# EAGLE design seven_seg_thermocouple_one (EAGLE 6.1)
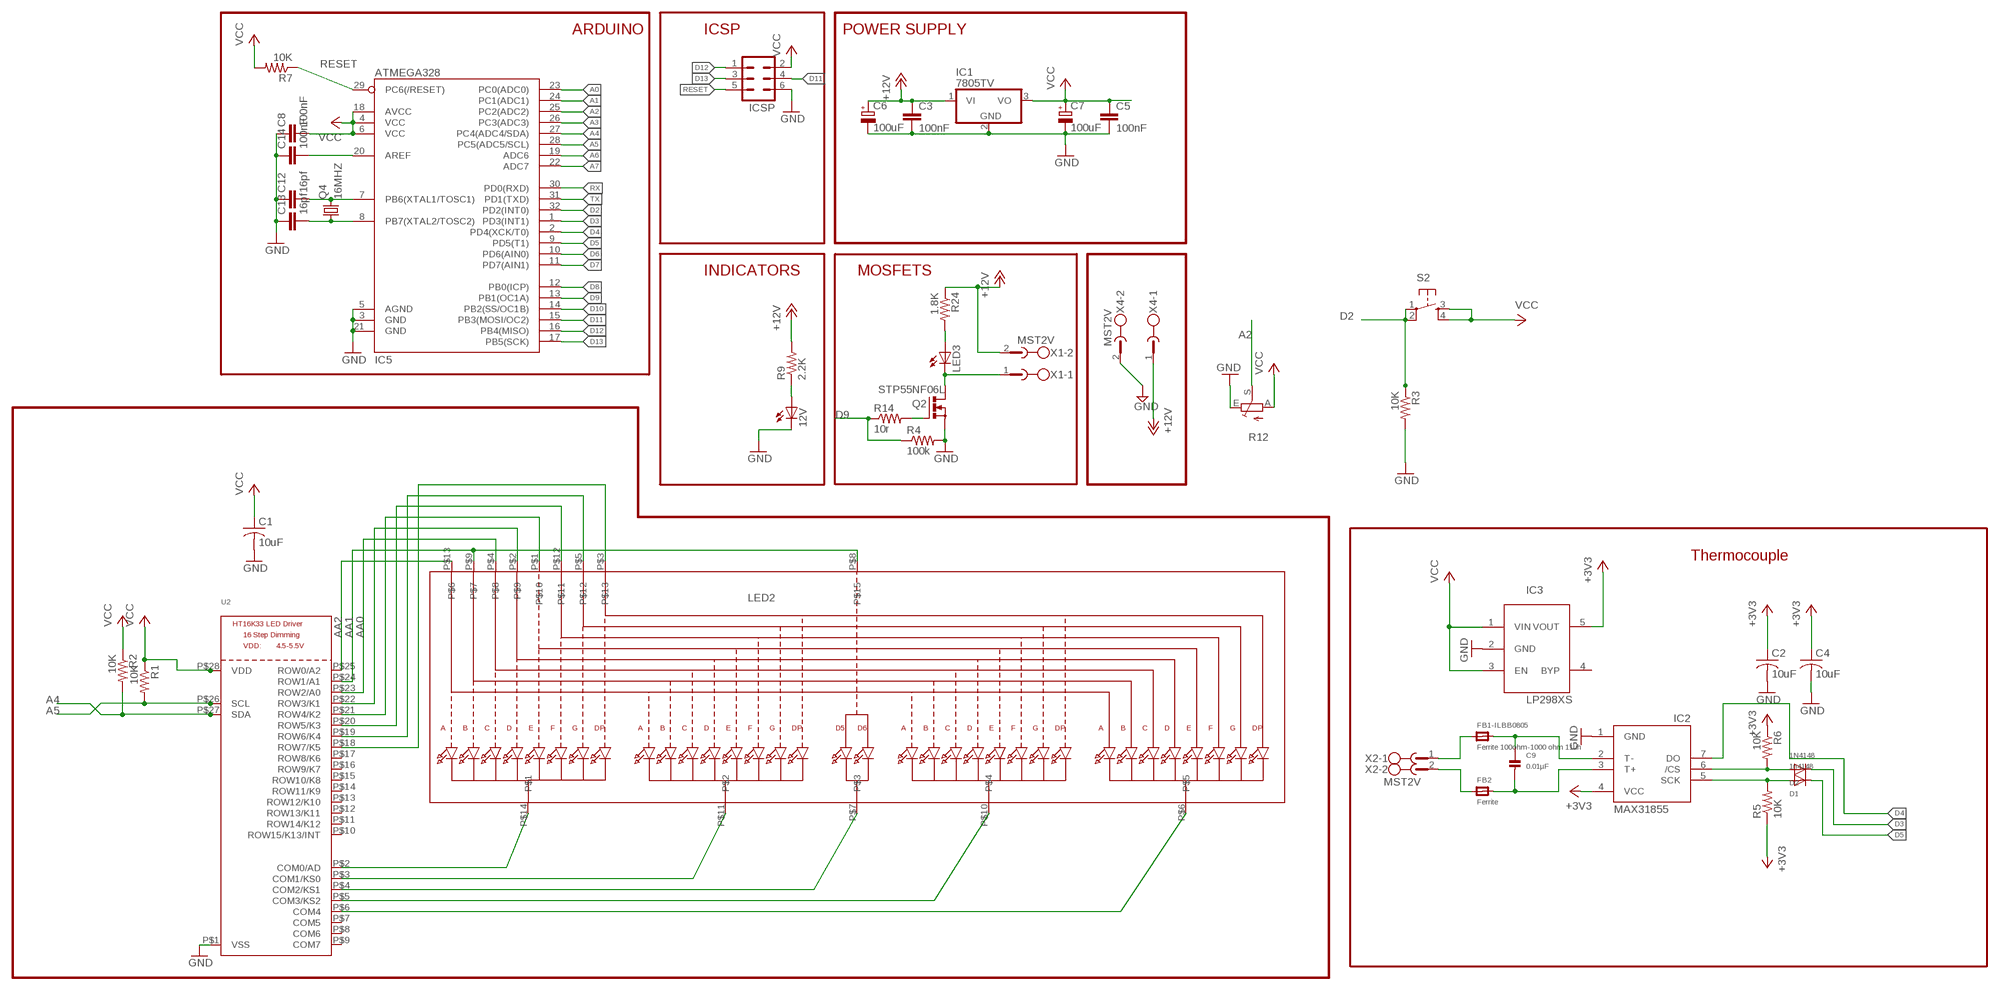
[diagram p0: schematic, sheet 1]

## Parts
12V  LED0805  [LED-0805]
C1  10uF  C-USC0805K  [C0805K]
C2  10uF  C-USC0805K  [C0805K]
C3  100nF  CAP0805  [0805]
C4  10uF  C-USC0805K  [C0805K]
C5  100nF  CAP0805  [0805]
C6  100uF  CPOL-EUE3.5-8  [E3,5-8]
C7  100uF  CPOL-EUE3.5-8  [E3,5-8]
C8  100nF  CAP0805  [0805]
C9  0.01µF  CAP_CERAMIC_0805  [_0805]
C12  16pf  CAP0805  [0805]
C13  16pf  CAP0805  [0805]
C14  100nF  CAP0805  [0805]
D1  1n4148  DIODESOD-323F  [SOD-323F]
D2  1N4148  DIODESOD-323F  [SOD-323F]
FB1-ILBB0805  Ferrite 100ohm-1000 ohm 11uh  FERRITE_0805  [_0805]
FB2  Ferrite  FERRITE_0805  [_0805]
IC1  7805TV  [TO220V]
IC2  MAX31855  MAX6675  [SO08]
IC3  LP298XS  [SOT23-5L]
IC5  ATMEGA328  ATMEGA168  [TQFP32-08]
ICSP  ML6  [ML6]
LED2  DISP_SEGMENT_4DIGIT_BL-Q56C43  [SEGMENT-BL-Q56C43]
LED3  LEDCHIP-LED0805  [CHIP-LED0805]
Q2  STP55NF06L  IRF512  [TO220BV]
Q4  16MHZ  CRYSTALHC49S  [HC49/S]
R1  10K  R-US_R0805  [R0805]
R2  10K  R-US_R0805  [R0805]
R3  10K  RESISTOR  [0805]
R4  100k  R-US_R0805  [R0805]
R5  10K  R-US_R0805  [R0805]
R6  10K  R-US_R0805  [R0805]
R7  10K  RESISTOR  [0805]
R9  2.2K  RESISTOR  [0805]
R12  TRIM_EU-B25U  [B25U]
R14  10r  R-US_M0805  [M0805]
R24  1.8K  R-US_R0805  [R0805]
S2  TAC_SWITCHPTH  [TACTILE-PTH]
U2  HT16K33_SOP28  [SOP28_300MIL]
X1  MST2V  [MSTBV2]
X2  MST2V  [MSTBV2]
X4  MST2V  [MSTBV2]

## Nets
+3V3: C2.1 C4.1 IC2.4(VCC) IC3.5(VOUT) R5.1 R6.1
+12V [motors]: C3.1 C6.+ IC1.1(VI) R9.2 R24.1 X1.2 X4.1
A0: IC5.23(PC0(ADC0))
A1: IC5.24(PC1(ADC1))
A2: IC5.25(PC2(ADC2)) R12.S
A3: IC5.26(PC3(ADC3))
A4: IC5.27(PC4(ADC4/SDA)) R2.2 U2.P$27(SDA)
A5: IC5.28(PC5(ADC5/SCL)) R1.2 U2.P$26(SCL)
A6: IC5.19(ADC6)
A7: IC5.22(ADC7)
AA0: LED2.P$4 U2.P$23(ROW2/A0)
AA1: LED2.P$8 LED2.P$9 U2.P$24(ROW1/A1)
AA2: LED2.P$13 U2.P$25(ROW0/A2)
CS: D2.A IC2.6(/CS) R6.2
D2: IC5.32(PD2(INT0)) R3.1 S2.1 S2.2
D3: D2.C IC5.1(PD3(INT1))
D4: IC2.7(DO) IC5.2(PD4(XCK/T0))
D5: D1.C IC5.9(PD5(T1))
D6: IC5.10(PD6(AIN0))
D7: IC5.11(PD7(AIN1))
D8: IC5.12(PB0(ICP))
D9: IC5.13(PB1(OC1A)) R4.1 R14.1
D10: IC5.14(PB2(SS/OC1B))
D11: IC5.15(PB3(MOSI/OC2)) ICSP.4
D12: IC5.16(PB4(MISO)) ICSP.1
D13: IC5.17(PB5(SCK)) ICSP.3
GND [motors]: 12V.C C1.2 C2.2 C3.2 C4.2 C5.2 C6.- C7.- C8.1 C12.1 C13.1 C14.1 IC1.2(GND) IC2.1(GND) IC3.2(GND) IC5.3(GND) IC5.5(AGND) IC5.21(GND) ICSP.6 Q2.S R3.2 R4.2 R12.E U2.P$1(VSS) X4.2
N$1: FB1-ILBB0805.1 X2.1
N$2: LED2.P$14 U2.P$2(COM0/AD)
N$3: LED2.P$11 U2.P$3(COM1/KS0)
N$4: LED2.P$7 U2.P$4(COM2/KS1)
N$5: LED2.P$10 U2.P$5(COM3/KS2)
N$6: LED2.P$6 U2.P$6(COM4)
N$7 [motors]: LED3.C Q2.D X1.1
N$8: C9.1 FB1-ILBB0805.2 IC2.2(T-)
N$9: FB2.1 X2.2
N$10: LED2.P$2 U2.P$22(ROW3/K1)
N$11: LED2.P$1 U2.P$21(ROW4/K2)
N$12: LED2.P$12 U2.P$20(ROW5/K3)
N$13: LED2.P$5 U2.P$19(ROW6/K4)
N$14: C9.2 FB2.2 IC2.3(T+)
N$16: LED2.P$3 U2.P$18(ROW7/K5)
N$20: C14.2 IC5.20(AREF)
N$26: 12V.A R9.1
N$31: C12.2 IC5.7(PB6(XTAL1/TOSC1)) Q4.2
N$32: C13.2 IC5.8(PB7(XTAL2/TOSC2)) Q4.1
N$45: LED3.A R24.2
N$47: Q2.G R14.2
RESET: IC5.29(PC6(/RESET)) ICSP.5 R7.1
RX: IC5.30(PD0(RXD))
SCK: D1.A IC2.5(SCK) R5.2
TX: IC5.31(PD1(TXD))
VCC: C1.1 C5.1 C7.+ C8.2 IC1.3(VO) IC3.1(VIN) IC3.3(EN) IC5.4(VCC) IC5.6(VCC) IC5.18(AVCC) ICSP.2 R1.1 R2.1 R7.2 R12.A S2.3 S2.4 U2.P$28(VDD)
Unconnected: IC3.4(BYP) U2.P$7(COM5) U2.P$8(COM6) U2.P$9(COM7) U2.P$10(ROW15/K13/INT) U2.P$11(ROW14/K12) U2.P$12(ROW13/K11) U2.P$13(ROW12/K10) U2.P$14(ROW11/K9) U2.P$15(ROW10/K8) U2.P$16(ROW9/K7) U2.P$17(ROW8/K6)

## Notes on the sheet
- ARDUINO | ICSP | POWER SUPPLY
- INDICATORS | MOSFETS
- Thermocouple

## Library data of the parts
12V = SparkFun:LED: LEDs Standard schematic elements and footprints for 5mm, 3mm, 1206, and 0603 sized LEDs. 5mm - Spark Fun Electronics SKU : COM-00529 (and others)
C1 C2 C4 = adafruit:C-US: CAPACITOR, American symbol
C3 C5 C8 C12-C14 = SparkFun:CAP: Capacitor Standard 0603 ceramic capacitor, and 0.1" leaded capacitor.
C6 C7 = rcl:CPOL-EU: POLARIZED CAPACITOR, European symbol
C9 = microbuilder:CAP_CERAMIC: Ceramic Capacitors 0402 - 0402 Surface Mount Capacitors 16pF 50V 5% [Digikey: 445-4899-2-ND] 18pF 50V 5% [Digikey: 490-1281-2-ND] 22pF 50V 5% [Digikey: 490-1283-2-ND] 68pF 50V 5% [Digikey: 490-1289-2-ND] 0.1uF 10V 10% [Digikey: 490-1318-2-ND] 1.0uF 6.3V 10% [Digikey: 490-1320-2-ND] 0603 - 0603 Surface Mount Capacitors 16 pF 50V 5% [Digikey: 445-5051-2-ND] 22 pF 50V [Digikey: PCC220ACVTR-ND] 33 pF 50V 5% [Digikey: 490-1415-1-ND] 56pF 50V 5% [Digikey: 490-1421-1-ND] 220pF 50V 5% [Digikey: 445-1285-1-ND] 680 pF 50V 2200 pF 50V 5% C0G [Digikey: 445-1297-1-ND] 5600 pF 100V 5% X7R [Digikey: 478-3711-1-ND] 0.1 µF 25V 10% [Digikey: PCC2277TR-ND] 0.22 µF 16V 10% X7R [Digikey: 445-1318-1-ND] 1.0 µF 25V 10% [Digikey: 445-5146-2-ND] 0603 - RF Specific 3pF 250V +/-0.1pF RF [Digikey: 712-1347-1-ND] 18 pF 250V 5% [Digikey: 478-3505-1-ND or 712-1322-1-ND] 56 pF 250V 5% C0G RF [Digikey: 490-4867-1-ND] 68 pF 250V RF [Digikey: 490-4868-1-ND] 0805 - 0805 Surface Mount Capacitors 220 pF 250V 2% RF Ceramic Capacitor [Digikey: 712-1398-1-ND] 1000 pF 50V 2% NP0 Ceramic Capacitor [Digikey: 478-3760-1-ND] 0.1 µF 25V 10% Ceramic Capacitor [Digikey: PCC1828TR-ND] 1.0 µF 16V 10% Ceramic Capacitor[Digikey: 490-1691-2-ND] 10.0 µF 10V 10% Ceramic Capacitor[Digikey: 709-1228-1-ND] 10.0 uF 16V 10% Ceramic Capacitor [Digikey: 478-5165-2-ND] 47 uF 6.3V 20% Ceramic Capacitor [Digikey: 587-1779-1-ND or 399-5506-1-ND] 1206 - 1206 Surface Mount Capacitors 47uF 10V 20% Ceramic Capacitor [Digikey: 490-5528-1-ND or 399-5508-1-ND or 445-6010-1-ND] 100uF 6.3V -20%, +80% Y5V Ceramic Capacitor (Digikey: 490-4512-1-ND, Mouser: 81-GRM31CF50J107ZE1L)
D1 D2 = adafruit:DIODE: Diode SMADIODE - SMA Surface Mount Package 20V 1A Schottky Diode Digikey: 641-1014-6-ND DO-1N4148 - Through Hole Small Current Diode SOD-123 20V 1 A (.5mV Vf) Schottky Diode - Digikey: MBRX120TPMSCT-ND SOD-323 10V 570mA (.38mV Vf, 3ns) Schottky Diode - Digikey: ZLLS410CT-ND SOD-523 30V 30mA Schottky Diode (RB751S-40TE61) - Digikey: RB751S-40TE61CT-ND SOT23-R/W - SOT23 Package (R = Solder Paste/Reflow Ovens, W = Hand-Soldering) BAT54Film 40V 300mA - Digikey: 497-7162-1-ND
FB1-ILBB0805 FB2 = microbuilder:FERRITE: Ferrite Bead 0603 MMZ1608B121C - 120 Ohm @ 100MHz, 600mA, 0.15 Ohm DC Resistance - Digikey: 445-2164-1-ND BK1608HW121-T - 120 Ohm, 600mA Ferrite Chip - Digikey: 587-1876-2-ND 0805 HZ0805B272R-10 - 2.7K Ohm @ 100MHz, 200mA, 0.8 Ohm DC Resistance - Digikey: 240-2504-1-ND (see also Murata BLM21BD272SN1L) MMZ2012Y152B - 1.5K Ohm @ 100MHz, 500mA, 0.4 Ohm DC Resistance - Digikey: 445-1560-1-ND - Mainly for high frequency (80-400MHz) MMZ2012R102A - 1K Ohm @ 100MHz, 500mA, 0.3 Ohm DC Resistance - Digikey: 445-1555-2-ND - More general purpose (10-200MHz)
IC1 = linear:78*: Positive VOLTAGE REGULATOR Source: http://cache.national.com/ds/LM/LM78L05.pdf http://www.fairchildsemi.com/ds/LM/LM7805.pdf
IC2 = adafruit:MAX6675
IC3 = adafruit:LP298X
IC5 = SparkFun:ATMEGA168
ICSP = con-harting-ml:ML6: HARTING
LED2 = microbuilder:DISP_SEGMENT_4DIGIT_BL-Q56C43
LED3 = led:LED: LED OSRAM: - CHIPLED LG R971, LG N971, LY N971, LG Q971, LY Q971, LO R971, LY R971 LH N974, LH R974 LS Q976, LO Q976, LY Q976 LO Q996 - Hyper CHIPLED LW Q18S LB Q993, LB Q99A, LB R99A - SideLED LS A670, LO A670, LY A670, LG A670, LP A670 LB A673, LV A673, LT A673, LW A673 LH A674 LY A675 LS A676, LA A676, LO A676, LY A676, LW A676 LS A679, LY A679, LG A679 - Hyper Micro SIDELED® LS Y876, LA Y876, LO Y876, LY Y876 LT Y87S - SmartLED LW L88C, LW L88S LB L89C, LB L89S, LG L890 LS L89K, LO L89K, LY L89K LS L896, LA L896, LO L896, LY L896 - TOPLED LS T670, LO T670, LY T670, LG T670, LP T670 LSG T670, LSP T670, LSY T670, LOP T670, LYG T670 LG T671, LOG T671, LSG T671 LB T673, LV T673, LT T673, LW T673 LH T674 LS T676, LA T676, LO T676, LY T676, LB T676, LH T676, LSB T676, LW T676 LB T67C, LV T67C, LT T67C, LS T67K, LO T67K, LY T67K, LW E67C LS E67B, LA E67B, LO E67B, LY E67B, LB E67C, LV E67C, LT E67C LW T67C LS T679, LY T679, LG T679 LS T770, LO T770, LY T770, LG T770, LP T770 LB T773, LV T773, LT T773, LW T773 LH T774 LS E675, LA E675, LY E675, LS T675 LS T776, LA T776, LO T776, LY T776, LB T776 LHGB T686 LT T68C, LB T68C - Hyper Mini TOPLED® LB M676 - Mini TOPLED Santana® LG M470 LS M47K, LO M47K, LY M47K Source: http://www.osram.convergy.de LUXEON: - LUMILED® LXK2-PW12-R00, LXK2-PW12-S00, LXK2-PW14-U00, LXK2-PW14-V00 LXK2-PM12-R00, LXK2-PM12-S00, LXK2-PM14-U00 LXK2-PE12-Q00, LXK2-PE12-R00, LXK2-PE12-S00, LXK2-PE14-T00, LXK2-PE14-U00 LXK2-PB12-K00, LXK2-PB12-L00, LXK2-PB12-M00, LXK2-PB14-N00, LXK2-PB14-P00, LXK2-PB14-Q00 LXK2-PR12-L00, LXK2-PR12-M00, LXK2-PR14-Q00, LXK2-PR14-R00 LXK2-PD12-Q00, LXK2-PD12-R00, LXK2-PD12-S00 LXK2-PH12-R00, LXK2-PH12-S00 LXK2-PL12-P00, LXK2-PL12-Q00, LXK2-PL12-R00 Source: www.luxeon.com KINGBRIGHT: KA-3528ASYC Source: www.kingbright.com
Q2 = transistor-power:IRF512: N-CHANNEL MOS FET
Q4 = crystal:CRYSTAL: CRYSTAL
R1 R2 R4-R6 R24 = adafruit:R-US_: RESISTOR, American symbol
R3 R7 R9 = SparkFun:RESISTOR: Resistor Basic schematic elements and footprints for 0603, 1206, and PTH 1/10th watt (small) resistors.
R12 = pot:TRIM_EU-: POTENTIOMETER
R14 = resistor:R-US_: RESISTOR, American symbol
S2 = SparkFun-Retired:TAC_SWITCH: Momentary Switch Button commonly used for reset or general input. Spark Fun Electronics SKU : COM-00097 SMT- SWCH-08247
U2 = microbuilder:HT16K33_SOP28
X1 X2 X4 = con-phoenix-508:MST2V: PHOENIX

## Net classes
0 default: width 0.152 mm, drill 0.305 mm, clearance 0.152 mm
1 vcc: width 0.254 mm
2 motors: width 1.016 mm

## Board
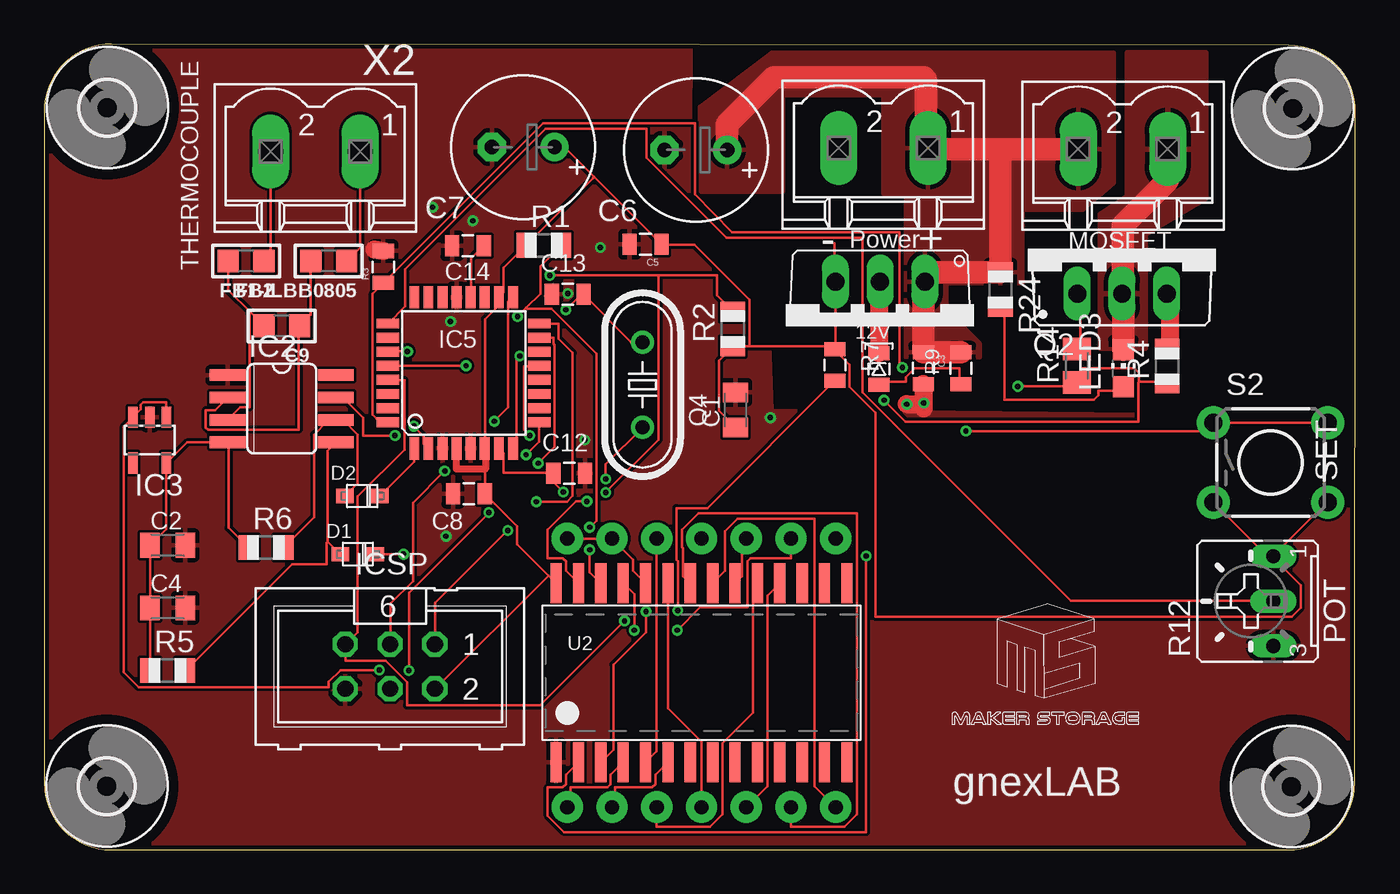
[diagram p1: board, top side]
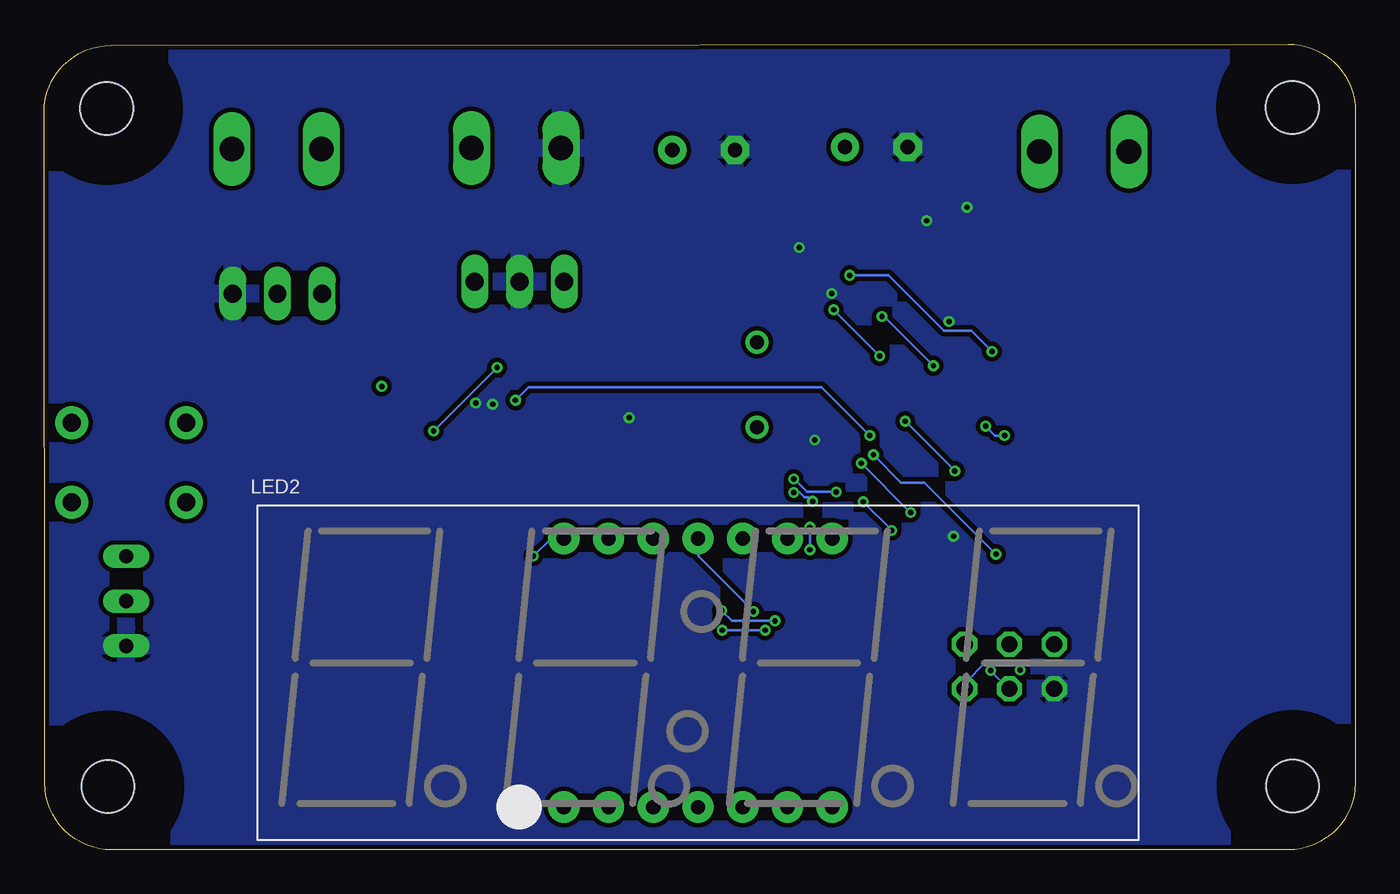
[diagram p2: board, bottom side, seen from below]

Size 74.45 x 45.73 mm. Coordinates in mm from the lower left corner, seen from the top.
Outline: 0,41.92 0.01,3.82 arc90 3.82,0 70.6,0 arc90 74.41,3.81 74.45,41.85 arc90 70.64,45.66 3.81,45.73 arc90 0,41.92
Copper layers (1*16): Top 0.035mm / dielectric 1.5mm / Bottom 0.035mm
Design rules: minimum track width 6mil, minimum drill 12mil, track to track 6mil, track to pad 6mil, pad to pad 6mil, via to via 6mil, smd to smd 0mil, copper to edge 10mil, drill to drill 10mil, minimum pad ring 10mil, minimum via ring 6mil, stop-mask expansion 2mil, vias tented up to drill 100mil, thermal gap 10mil

### Footprints (pad centres in the part's own frame; a part is rotated, then mirrored left to right if it is on the bottom)
LED-0805 = smd 1.2 x 0.8: A 0,-0.9; C 0,0.9
C0805K = smd 1.1 x 1.4: 1 -1,0; 2 1,0
0805 = smd 0.8 x 1.2: 1 -0.9,0; 2 0.9,0
E3,5-8 = drill 0.813 pad 1.6: + -1.778,0 | drill 0.813 pad 1.6 octagon: - 1.778,0
_0805 = smd 1.2 x 1.3: 1 -1.016,0; 2 1.016,0
SOD-323F = smd 1 x 0.8: A -1,0; C 1,0
TO220V = drill 1.016 long: 1 -2.54,-2.54; 2 0,-2.54; 3 2.54,-2.54
SO08 = smd 0.66 x 2.032: 1 -1.905,-3.073; 2 -0.635,-3.073; 3 0.635,-3.073; 4 1.905,-3.073; 5 1.905,3.073; 6 0.635,3.073; 7 -0.635,3.073; 8 -1.905,3.073
SOT23-5L = smd 0.55 x 1.2: 1 -0.95,-1.3; 2 0,-1.3; 3 0.95,-1.3; 4 0.95,1.3; 5 -0.95,1.3
TQFP32-08 = smd 1.27 x 0.559: 1 -4.293,2.8; 2 -4.293,2; 3 -4.293,1.2; 4 -4.293,0.4; 5 -4.293,-0.4; 6 -4.293,-1.2; 7 -4.293,-2; 8 -4.293,-2.8; 17 4.293,-2.8; 18 4.293,-2; 19 4.293,-1.2; 20 4.293,-0.4; 21 4.293,0.4; 22 4.293,1.2; 23 4.293,2; 24 4.293,2.8 | smd 0.559 x 1.27: 9 -2.8,-4.293; 10 -2,-4.293; 11 -1.2,-4.293; 12 -0.4,-4.293; 13 0.4,-4.293; 14 1.2,-4.293; 15 2,-4.293; 16 2.8,-4.293; 25 2.8,4.293; 26 2,4.293; 27 1.2,4.293; 28 0.4,4.293; 29 -0.4,4.293; 30 -1.2,4.293; 31 -2,4.293; 32 -2.8,4.293
ML6 = drill 0.914 octagon: 1 -2.54,-1.27; 2 -2.54,1.27; 3 0,-1.27; 4 0,1.27; 5 2.54,-1.27; 6 2.54,1.27
SEGMENT-BL-Q56C43 = drill 0.8 pad 1.778: P$1 -7.62,-7.62; P$2 -5.08,-7.62; P$3 -2.54,-7.62; P$4 0,-7.62; P$5 2.54,-7.62; P$6 5.08,-7.62; P$7 7.62,-7.62; P$8 7.62,7.62; P$9 5.08,7.62; P$10 2.54,7.62; P$11 0,7.62; P$12 -2.54,7.62; P$13 -5.08,7.62; P$14 -7.62,7.62
CHIP-LED0805 = smd 1.2 x 1.2: A 0,-1.05; C 0,1.05
TO220BV = drill 1.016 long: D 0,-2.54; G -2.54,-2.54; S 2.54,-2.54
HC49/S = drill 0.813: 1 -2.413,0; 2 2.413,0
R0805 = smd 1.1 x 1.4: 1 -1,0; 2 1,0
B25U = drill 0.813 long: A 2.54,-0.889; E -2.54,-0.889; S 0,-0.889
M0805 = smd 1.3 x 1.6: 1 -0.95,0; 2 0.95,0
TACTILE-PTH = drill 1.016 pad 1.88: 1 -3.251,2.261; 2 3.251,2.261; 3 -3.251,-2.261; 4 3.251,-2.261
SOP28_300MIL = smd 0.635 x 2.286: P$1 -8.255,-5.08; P$2 -6.985,-5.08; P$3 -5.715,-5.08; P$4 -4.445,-5.08; P$5 -3.175,-5.08; P$6 -1.905,-5.08; P$7 -0.635,-5.08; P$8 0.635,-5.08; P$9 1.905,-5.08; P$10 3.175,-5.08; P$11 4.445,-5.08; P$12 5.715,-5.08; P$13 6.985,-5.08; P$14 8.255,-5.08; P$15 8.255,5.08; P$16 6.985,5.08; P$17 5.715,5.08; P$18 4.445,5.08; P$19 3.175,5.08; P$20 1.905,5.08; P$21 0.635,5.08; P$22 -0.635,5.08; P$23 -1.905,5.08; P$24 -3.175,5.08; P$25 -4.445,5.08; P$26 -5.715,5.08; P$27 -6.985,5.08; P$28 -8.255,5.08
3,0 = hole 3: 0,0
MSTBV2 = drill 1.397 long: 1 -2.54,0; 2 2.54,0

### Placement (x,y rotation side)
12V  47.39,27.29 0 top
C1  39.25,24.96 90 top
C2  7.02,17.29 0 top
C3  49.92,27.33 270 top
C4  7.02,13.73 0 top
C5  34.14,34.37 180 top
C6  37.01,39.72 180 top
C7  27.2,39.88 180 top
C8  24.12,20.22 0 top
C9  13.5,29.73 180 top
C12  29.81,21.38 180 top
C13  29.72,31.53 0 top
C14  24.07,34.28 0 top
D1  17.82,16.78 0 top
D2  18.07,20.08 0 top
FB1-ILBB0805  16.16,33.42 180 top
FB2  11.47,33.42 180 top
IC1  47.46,29.7 180 top
IC2  13.5,25.03 270 top
IC3  6,23.26 180 top
IC5  23.82,27.07 90 top
ICSP  19.64,10.4 180 top
LED2  37.32,10.05 0 bottom
LED3  61.27,27.32 0 top
Q2  61.2,34.1 0 top
Q4  33.98,26.4 270 top
R1  28.38,34.31 0 top
R2  39.1,29.56 90 top
R3  19.26,33.09 90 top
R4  63.76,27.45 90 top
R5  7.02,10.18 0 top
R6  12.61,17.16 0 top
R7  44.89,27.51 90 top
R9  52.05,27.33 90 top
R12  68.89,14.12 90 top
R14  58.63,27.47 90 top
R24  54.29,31.79 270 top
S2  69.63,21.99 0 top
U2  37.32,10.05 0 top
U$1  [3,0]  3.56,3.62 0 top
U$2  [3,0]  70.89,42.07 0 top
U$3  [3,0]  3.59,42.12 0 top
U$4  [3,0]  70.81,3.59 0 top
X1  61.25,39.77 180 top
X2  15.4,39.64 180 top
X4  47.64,39.83 180 top

### Tracks (layer width: path | path; a pad name or v marks a point on that pad's centre or on a via)
+3V3
  Top 0.152: R5.1 C4.1 6.03,13.78 C2.1 6.08,17.34 6.94,18.2 6.94,21.88 IC3.5 6.97,21.96 8.14,23.13 IC2.4 10.47,23.08 10.47,18.28 11.59,17.16 R6.1
+12V
  Top 1.27: X1.2 54.52,39.77 | 54.52,39.77 50.24,39.77 X4.1 50.07,39.94 50.07,43.7 49.95,43.83 41.44,43.83 38.78,41.18 C6.+ | 54.52,39.77 54.29,39.54 R24.1 50.55,32.79 IC1.1 49.92,32.16 C3.1 R9.2
  pour Top: 60.74,45.23 60.74,37.86 58.96,36.34 55.53,36.34 55.53,32.15 51.22,32.15 51.22,30.62 53.12,28.72 53.12,27.96 48.93,27.96 48.93,37.23 47.66,37.23 47.66,42.81 41.95,42.81 41.95,37.35 37.25,37.35 37.25,42.18 41.31,45.23
A2
  Top 0.152: IC5.25 20.51,30.85 20.51,32.96 28.48,40.93 34.2,40.93 34.2,39.28 38.75,34.74 46.47,34.74 46.47,25.97 58.3,14.14 69.76,14.14 R12.S
A4  (via drill 0.3)
  Top 0.152: 39.02,30.37 R2.2 39.08,30.62 38.21,31.49 38.21,32.6 34.88,32.6 | v20.63,28.29 19.54,28.29 IC5.27 | 34.88,32.6 v28.71,32.6 | U2.P$27 29.63,15.84 29.63,16.37 29.45,16.55 28.59,16.55 28.59,18.15 30.21,19.78 v30.82,19.78 | v31.89,20.28 34.88,23.28 34.88,32.6
  Bottom 0.152: v20.63,28.29 21.8,29.45 23.35,29.45 26.5,32.6 v28.71,32.6 | v30.82,19.78 31.05,20.01 31.28,20.01 31.56,20.28 v31.89,20.28
A5  (via drill 0.3)
  Top 0.152: v23.96,27.47 19.54,27.47 IC5.28 | 27.37,30.75 28.18,31.56 28.18,33.11 R1.2 | 27.37,30.75 v26.88,30.27 | U2.P$26 30.97,15.76 v30.97,17.03 | v30.97,18.3 31.35,18.68 31.35,28.16 28.81,30.7 27.42,30.7 27.37,30.75
  Bottom 0.152: v23.96,27.47 26.76,30.27 v26.88,30.27 | v30.97,18.3 v30.97,17.03
AA0
  Top 0.152: U2.P$23 35.42,8.04 37.32,6.14 LED2.P$4
AA1
  Top 0.152: U2.P$24 33.44,15.84 33.44,16.47 LED2.P$9 LED2.P$8
AA2  (via drill 0.3)
  Top 0.152: U2.P$25 33.51,14.49 v33.51,12.46 | v35.95,12.46 37.25,13.76 39.94,13.76 39.94,16.37 40.12,16.55 42.4,16.55 LED2.P$13
  Bottom 0.152: v35.95,12.46 v33.51,12.46
CS
  Top 0.152: D2.A 17.82,20.82 17.82,23.56 16.98,24.4 IC2.6 16.52,24.35 16.11,24.35 15.33,23.56 15.33,18.86 13.62,17.16 R6.2
D2  (via drill 0.3)
  Top 0.152: IC5.32 19.06,24.27 18.65,24.68 18.65,31.56 19.26,32.17 R3.1 19.31,32.22 28.33,41.24 36.95,41.24 36.95,37.2 39.05,35.04 48.55,35.04 48.55,27.55 v48.73,27.37 | S2.2 S2.1 66.33,24.2 66.33,23.76 v52.33,23.76
  Bottom 0.152: v52.33,23.76 v48.73,27.37
D3
  Top 0.152: D2.C 19.09,20.08 21.02,22.01 IC5.1
D4  (via drill 0.3)
  Top 0.152: v20.99,24.04 21.55,23.49 21.55,23.05 21.8,22.8 IC5.2 | v19.92,23.51 18.12,23.51 18.12,24.53 16.98,25.67 IC2.7
  Bottom 0.152: v20.99,24.04 20.46,23.51 v19.92,23.51
D5  (via drill 0.3)
  Top 0.152: v20.41,16.78 D1.C | v27.37,22.42 28.1,23.15 28.1,24.25 IC5.9
  Bottom 0.152: v20.41,16.78 24.47,20.84 25.79,20.84 v27.37,22.42
D9  (via drill 0.3)
  Top 0.152: v55.28,26.3 58.58,26.3 R14.1 58.84,26.56 58.84,27.32 61.88,27.32 62.14,27.07 62.14,26.56 | 62.14,26.56 63.66,26.56 R4.1 | v27.57,23.51 27.24,23.84 27.24,27.45 28.1,27.45 IC5.13 | v47.69,25.52 48.91,24.3 62.11,24.3 62.11,26.51 62.14,26.56
  Bottom 0.152: v27.57,23.51 30.31,26.25 46.95,26.25 v47.69,25.52
D11  (via drill 0.3)
  Top 0.152: v28.05,21.94 28.99,22.88 28.99,28.64 28.92,28.72 28.92,29.05 28.13,29.05 IC5.15 | v25.26,19.14 20.71,14.6 v20.71,10.18
  Bottom 0.152: v25.26,19.14 v28.05,21.94 | v20.71,10.18 19.67,9.13 ICSP.4
D12  (via drill 0.3)
  Top 0.152: v27.95,19.75 29.68,19.75 30.01,20.08 30.01,28.21 29.22,29 29.22,29.86 28.13,29.86 IC5.16 | v26.32,18.13 22.21,14.01 22.21,11.67 ICSP.1
  Bottom 0.152: v26.32,18.13 v27.95,19.75
D13  (via drill 0.3)
  Top 0.152: v25.56,24.32 26.35,25.11 26.35,31.11 26.6,31.36 IC5.17 | v22.74,21.5 20.94,19.7 20.94,15.26 19.67,13.99 19.67,11.67 ICSP.3
  Bottom 0.152: v22.74,21.5 v25.56,24.32
GND  (via drill 0.3)
  Top 1.016: 49.95,25.03 49.95,25.29 | 49.95,25.29 v49.95,25.36 49.95,26.3 C3.2 | 12V.C 47.41,28.34 47.41,32.15 IC1.2 | R4.2 63.92,28.59 63.92,31.38 Q2.S | v48.98,25.29 49.95,25.29 | R3.2 18.76,34.08 18.76,34.06
  other vias: 41.23,24.53 22.06,36.46 24.34,35.7 23.07,29.99 30.69,23.26 22.82,17.8 31.58,34.18 29.74,31.57
  pour Bottom (isolate 0.254): -9.3,66.25 79.74,66.23 78.51,-12.92 -6.83,-13.32
  pour Top: 36.61,35.19 36.74,48.02 -2.25,48.4 -2,-4.68 76.49,-4.68 76.62,47.01 67.22,47.01 67.09,28.08 64.81,24.65 41.31,24.91 40.93,35.19
N$1
  Top 0.152: FB1-ILBB0805.1 17.94,34.18 X2.1
N$2  (via drill 0.3)
  Top 0.152: U2.P$2 29.63,4.26 29.63,3.72 29.45,3.55 28.59,3.55 28.59,1.95 29.52,1.01 46.67,1.01 v46.67,16.68
  Bottom 0.152: v46.67,16.68 45.68,17.67 LED2.P$14
N$3  (via drill 0.3)
  Top 0.152: U2.P$3 32.32,5.68 32.32,10.51 34.17,12.36 v34.17,13.53
  Bottom 0.152: v34.17,13.53 37.3,16.65 37.3,17.67 LED2.P$11
N$4
  Top 0.152: U2.P$4 32.17,4.26 32.17,3.72 31.99,3.55 29.88,3.55 29.88,2.61 LED2.P$7
N$5
  Top 0.152: U2.P$5 34.78,5.6 LED2.P$10
N$6
  Top 0.152: U2.P$6 34.71,4.26 34.71,3.72 34.53,3.55 32.42,3.55 32.42,2.61 LED2.P$6
N$7
  Top 1.27: X1.1 63.79,37.99 61.25,35.45 61.25,31.61 Q2.D 61.27,31.49 LED3.C
  pour Top: 62.52,28.46 59.98,28.46 59.98,36.08 61.5,37.1 61.5,45.23 65.95,45.23 65.95,36.97 62.52,34.94
N$8
  Top 0.152: FB1-ILBB0805.2 15.15,30.37 C9.1 14.46,29.68 14.46,23.84 9.31,23.84 9.18,23.97 9.18,24.96 9.71,24.96 IC2.2
N$9
  Top 0.152: FB2.1 12.86,33.8 X2.2
N$10
  Top 0.152: U2.P$22 36.28,15.53 36.28,17.11 36.21,17.19 36.21,18.15 37.14,19.09 46.14,19.09 46.14,2.02 45.43,1.31 42.4,1.31 LED2.P$2
N$11
  Top 0.152: U2.P$21 38.67,15.84 38.67,18.07 39.38,18.79 43.75,18.79 43.75,3.62 LED2.P$1
N$12
  Top 0.152: U2.P$20 39.63,15.53 39.63,17.44 LED2.P$12
N$13
  Top 0.152: U2.P$19 40.24,14.87 40.24,7.79 38.52,6.06 38.52,2.02 37.81,1.31 34.78,1.31 LED2.P$5
N$14
  Top 0.152: 11.72,30.5 10.45,31.77 FB2.2 | 11.72,30.5 C9.2 | IC2.3 11.14,25.11 11.67,25.11 11.67,30.44 11.72,30.5
N$16
  Top 0.152: U2.P$18 41.06,14.42 41.06,3.62 LED2.P$3
N$20
  Top 0.152: C14.2 24.24,33.57 24.24,31.38 IC5.20
N$26
  Top 0.152: 12V.A 47.41,26.56 48.93,26.56 48.93,26.81 49.44,27.32 51.98,27.32 51.98,26.56 R9.1
N$31  (via drill 0.3)
  Top 0.152: IC5.7 25.84,22.77 26.1,22.52 26.1,21.4 28.89,21.4 C12.2 28.92,21.3 28.92,20.87 v29.47,20.31 | v31.89,21.05 31.89,21.88 33.97,23.97 Q4.2
  Bottom 0.152: v31.89,21.05 31.15,20.31 v29.47,20.31
N$32  (via drill 0.3)
  Top 0.152: Q4.1 33.97,28.82 33.33,28.82 30.64,31.51 C13.2 30.57,31.49 30.46,31.49 v29.63,30.65 | v27.01,28.03 26.83,27.85 26.83,23 26.63,22.8 IC5.8
  Bottom 0.152: v29.63,30.65 v27.01,28.03
N$45
  Top 0.152: LED3.A 61.12,26.05 59.85,26.05 59.85,25.8 59.6,25.54 54.52,25.54 54.52,30.62 R24.2
N$47
  Top 0.152: R14.2 58.84,28.59 58.84,31.38 Q2.G
RESET  (via drill 0.3)
  Top 0.152: v35.98,13.58 35.98,16.37 35.9,16.45 35.9,19.4 37.65,19.4 44.87,26.61 R7.1 | v32.95,12.99 28.15,8.19 20.61,8.19 20.61,9.52 19.39,10.73 17.13,10.73 17.13,11.67 ICSP.5 17.18,11.72 17.82,12.36 17.82,20.06 20.46,22.7 20.46,26.66 19.54,26.66 IC5.29
  Bottom 0.152: v35.98,13.58 35.39,12.99 v32.95,12.99
SCK
  Top 0.152: 16.09,17.49 16.8,16.78 D1.A | 16.09,17.49 16.09,22.65 IC2.5 | R5.2 8.04,10.18 14.08,16.22 16.04,16.22 16.04,17.44 16.09,17.49
VCC  (via drill 0.3)
  Top 0.152: 44.87,34.43 44.87,32.4 IC1.3 44.92,32.17 44.92,28.46 44.89,28.44 R7.2 | IC3.1 6.94,24.58 6.94,25.39 5.62,25.39 5.5,25.26 5.5,25.01 5.06,24.58 IC3.3 5.01,24.5 4.53,24.02 4.53,10.07 5.37,9.24 16.16,9.24 16.16,9.54 16.82,10.2 v19.03,10.2 | S2.4 72.83,19.73 69.78,16.68 R12.A | S2.3 69.43,16.68 69.71,16.68 R12.A | 28.64,15.56 26.86,17.34 26.86,18.35 25.05,20.16 C8.2 25.03,20.28 25.03,21.61 | 28.64,15.56 U2.P$28 | C1.1 38.31,24.91 38.31,27.75 39.1,28.54 R2.1 39.15,28.59 40.04,28.59 | 40.04,28.59 44.87,28.59 R7.2 | 31.23,38.19 29.55,39.87 28.99,39.87 C7.+ | 31.23,38.19 35.04,34.38 C5.1 35.11,34.33 36.92,34.33 40.04,31.21 40.04,28.59 | 31.23,38.19 31.18,38.14 31.18,38.12 27.42,34.36 R1.1 27.37,34.31 26.1,33.04 26.1,31.64 25.84,31.38 IC5.18 25.77,31.31 25.77,30.85 25.03,30.11 25.03,22.85 IC5.6 | R12.A 69.78,16.58 71.33,15.03 71.33,13.73 70.83,13.22 47.2,13.22 47.2,24.81 45.73,26.28 45.73,27.52 44.92,28.34 R7.2 | 28.64,15.56 22.21,9.13 ICSP.2
  Top 0.406: 25.03,22.85 25.05,22.85 25.05,21.61 25.03,21.61 23.42,21.61 IC5.4
  Bottom 0.152: v19.03,10.2 19.54,10.71 20.94,10.71 22.18,9.46 ICSP.2 | ICSP.2

### Text on the board
tPlace: THERMOCOUPLE | Power | MOSFET | - | + | SET | POT | gnexLAB